# EAGLE design brick_i2c_templature (EAGLE 7.2.0)
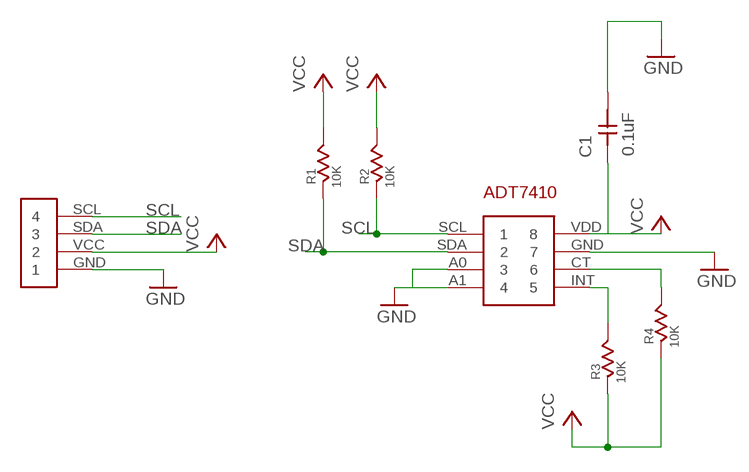
[diagram p0: schematic, sheet 1]

## Parts
C1  0.1uF  CAPACITOR_0603  [RESISTOR_0603]
R1  10K  RESISTOR_0603  [RESISTOR_0603]
R2  10K  RESISTOR_0603  [RESISTOR_0603]
R3  10K  RESISTOR_0603  [RESISTOR_0603]
R4  10K  RESISTOR_0603  [RESISTOR_0603]
U$1  I2C-ADT7410  [I2C-ADT7410]
U$2  BRICK_I2C  [BRICK_I2C]

## Nets
GND: C1.P$2 U$1.A0 U$1.A1 U$1.GND U$2.GND
N$2: R3.P$2 U$1.INT
N$3: R4.P$2 U$1.CT
SCL: R2.P$1 U$1.SCL U$2.SCL
SDA: R1.P$1 U$1.SDA U$2.SDA
VCC: C1.P$1 R1.P$2 R2.P$2 R3.P$1 R4.P$1 U$1.VDD U$2.VCC

## Library data of the parts
C1 = gclue:CAPACITOR_0603
R1-R4 = gclue:RESISTOR_0603
U$1 = gclue:I2C-ADT7410
U$2 = gclue:BRICK_I2C

## Board
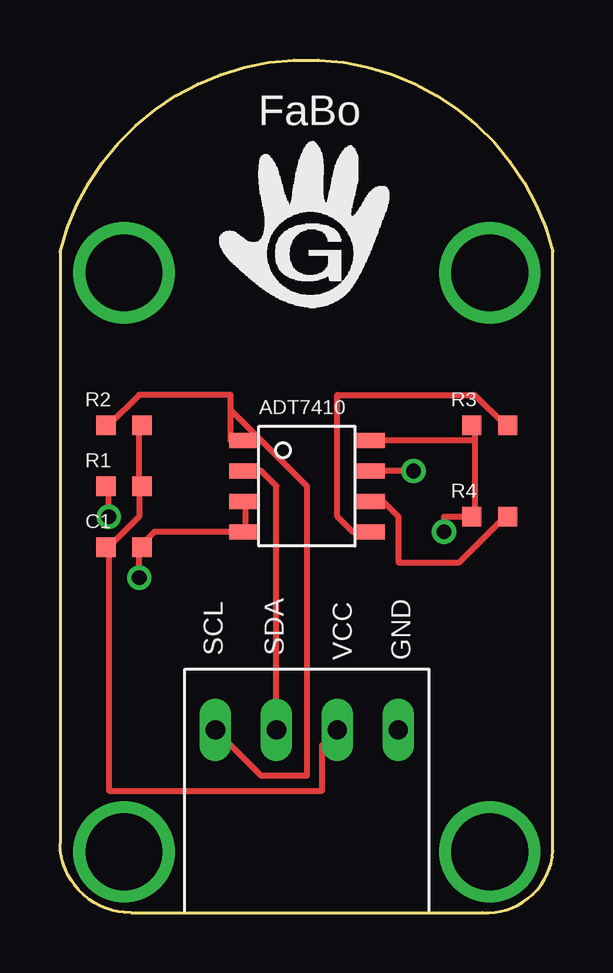
[diagram p1: board, top side]
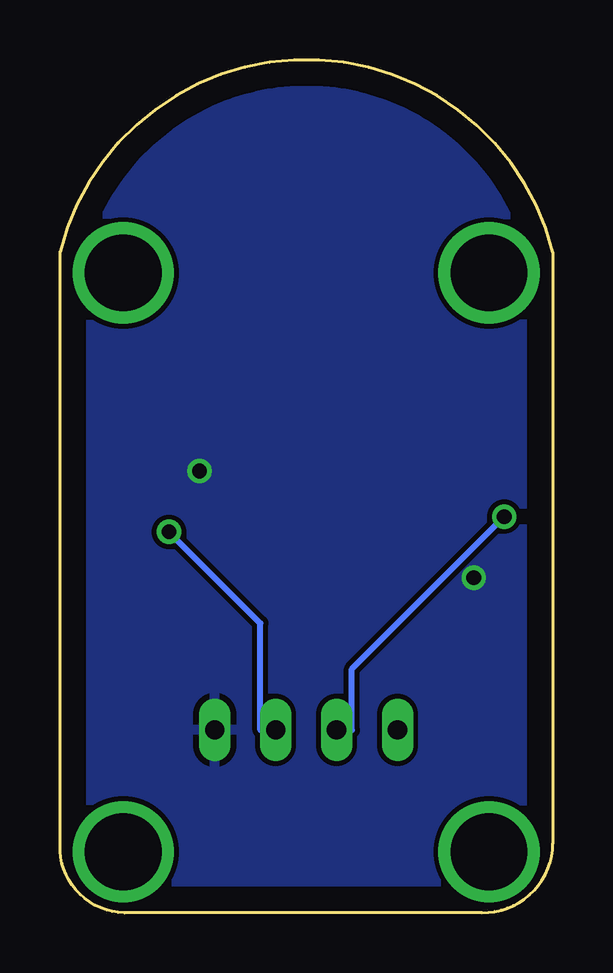
[diagram p2: board, bottom side, seen from below]

Size 20.54 x 35.55 mm. Coordinates in mm from the lower left corner, seen from the top.
Copper layers (1*16): Top 0.035mm / dielectric 1.5mm / Bottom 0.035mm
Design rules "default": minimum track width 10mil, minimum drill 24mil, track to track 8mil, track to pad 8mil, pad to pad 8mil, via to via 8mil, smd to smd 8mil, copper to edge 40mil, drill to drill 8mil, minimum pad ring 10mil, minimum via ring 8mil, stop-mask expansion 4mil, vias tented up to drill 0mil, thermal gap 10mil

### Footprints (pad centres in the part's own frame; a part is rotated, then mirrored left to right if it is on the bottom)
RESISTOR_0603 = smd 0.8 x 0.8: P$1 -0.75,0; P$2 0.75,0
I2C-ADT7410 = smd 1.27 x 0.635: A0 -2.6,-0.635; A1 -2.6,-1.905; CT 2.6,-0.635; GND 2.6,0.635; INT 2.6,-1.905; SCL -2.6,1.905; SDA -2.6,0.635; VDD 2.6,1.905
BRICK_I2C = drill 0.8 long: GND 3.81,-3.81; SCL -3.81,-3.81; SDA -1.27,-3.81; VCC 1.27,-3.81 | drill 3.2: P$5 -7.62,15.24; P$6 7.62,15.24; P$7 -7.62,-8.89; P$8 7.62,-8.89

### Placement (x,y rotation side)
C1  2.67,15.25 0 top
R1  2.67,17.79 0 top
R2  2.67,20.33 0 top
R3  17.91,20.33 0 top
R4  17.91,16.52 0 top
U$1  10.29,17.79 0 top
U$2  10.29,11.44 0 top

### Tracks (layer width: path | path; a pad name or v marks a point on that pad's centre or on a via)
GND  (via drill 0.61)
  Top 0.254: v3.3,13.98 3.3,15.25 | U$1.A0 7.75,17.15 7.75,15.88 U$1.A1 3.94,15.88 3.3,15.25 | 3.3,15.25 C1.P$2 | v14.73,18.42 U$1.GND
  pour Bottom: -1.14,35.57 21.72,35.57 21.72,0.01 -1.14,0.01
N$2
  Top 0.254: U$1.INT 12.19,15.88 11.56,16.52 11.56,21.6 17.27,21.6 18.54,20.33 R3.P$2
N$3
  Top 0.254: R4.P$2 18.54,16.52 16.64,14.61 14.1,14.61 14.1,16.52 13.46,17.15 U$1.CT
SCL
  Top 0.254: 7.11,20.96 7.11,19.69 U$1.SCL | 7.11,20.96 7.11,21.6 3.3,21.6 2.03,20.33 R2.P$1 | U$2.SCL 8.38,5.72 10.29,5.72 10.29,17.79 7.11,20.96
SDA  (via drill 0.61)
  Top 0.254: v2.03,16.52 2.03,17.79 R1.P$1 | U$1.SDA 8.38,18.42 9.02,17.79 U$2.SDA
  Bottom 0.254: v2.03,16.52 8.38,10.17 8.38,7.63 U$2.SDA
VCC  (via drill 0.61)
  Top 0.254: 17.27,19.69 17.27,20.33 R3.P$1 | 17.27,19.69 17.27,16.52 R4.P$1 16,16.52 v16,15.88 | 17.27,19.69 U$1.VDD | 2.03,15.25 3.3,16.52 3.3,17.79 | 3.3,17.79 3.3,20.33 R2.P$2 | 3.3,17.79 R1.P$2 | U$2.VCC 10.92,6.99 10.92,5.09 2.03,5.09 2.03,15.25 | 2.03,15.25 C1.P$1
  Bottom 0.254: v16,15.88 12.19,12.07 12.19,7.63 U$2.VCC